# Altium schematic sheet GBTx_MGT.SchDoc: GBTx_MGT
size A; Organization: UCLA High Energy Physics; Address1: L3, 12a Rodborough Rd; Address2: Frenchs Forest; Address3: NSW; Address4: Australia 2086; DocumentNumber: 11; Revision: 2.0; SheetNumber: 11; SheetTotal: 23; CurrentDate: 9/6/2018; ModifiedDate: 9/6/2018; ProjectName: Project
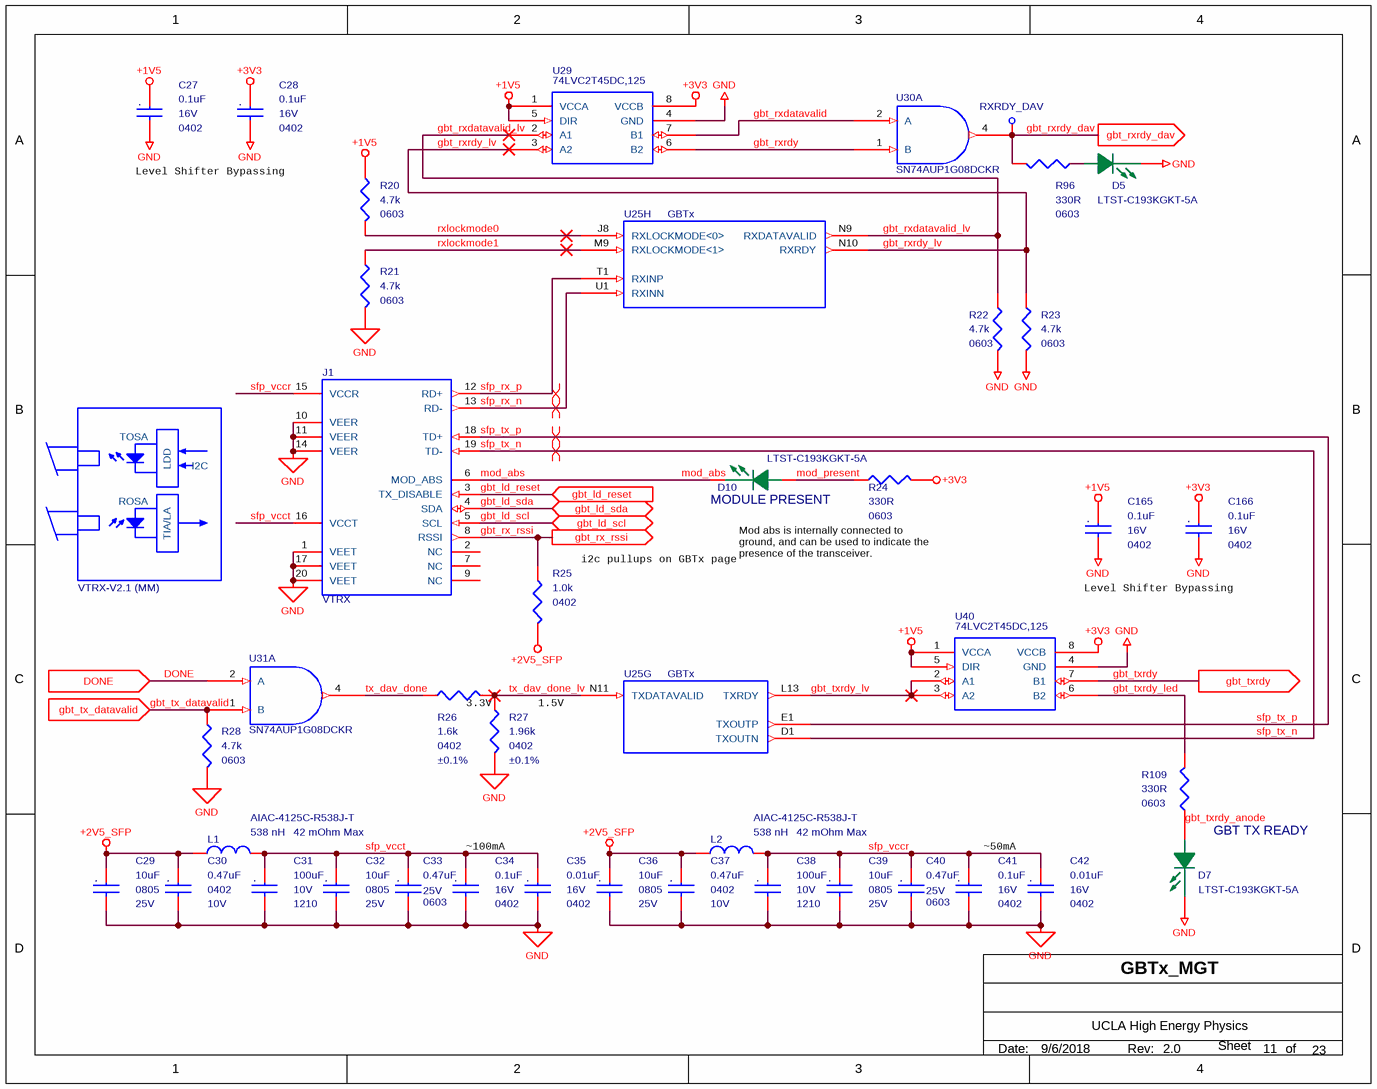
[diagram p0: GBTx_MGT.SchDoc]

## Parts
C27  0.1uF  package: 0402  Voltage - Rated: 16V  [MC_S6/SM/C_0402_IPC]
C28  0.1uF  package: 0402  Voltage - Rated: 16V  [MC_S6/SM/C_0402_IPC]
C29  10uF  Voltage - Rated: 25V  package: 0805  [MC_S6/SM/C_0805_IPC]
C30  0.47uF  Voltage - Rated: 10V  package: 0402  [MC_S6/SM/C_0402_IPC]
C31  100uF  Voltage - Rated: 10V  package: 1210  [MC_S6/SM/C_1210_IPC]
C32  10uF  Voltage - Rated: 25V  package: 0805  [MC_S6/SM/C_0805_IPC]
C33  0.47uF  Voltage - Rated: 25V  package: 0603  [MC_S6/SM/C_0603_IPC]
C34  0.1uF  package: 0402  Voltage - Rated: 16V  [MC_S6/SM/C_0402_IPC]
C35  0.01uF  Voltage - Rated: 16V  package: 0402  [MC_S6/SM/C_0402_IPC]
C36  10uF  Voltage - Rated: 25V  package: 0805  [MC_S6/SM/C_0805_IPC]
C37  0.47uF  Voltage - Rated: 10V  package: 0402  [MC_S6/SM/C_0402_IPC]
C38  100uF  Voltage - Rated: 10V  package: 1210  [MC_S6/SM/C_1210_IPC]
C39  10uF  Voltage - Rated: 25V  package: 0805  [MC_S6/SM/C_0805_IPC]
C40  0.47uF  Voltage - Rated: 25V  package: 0603  [MC_S6/SM/C_0603_IPC]
C41  0.1uF  package: 0402  Voltage - Rated: 16V  [MC_S6/SM/C_0402_IPC]
C42  0.01uF  Voltage - Rated: 16V  package: 0402  [MC_S6/SM/C_0402_IPC]
C165  0.1uF  package: 0402  Voltage - Rated: 16V  [MC_S6/SM/C_0402_IPC]
C166  0.1uF  package: 0402  Voltage - Rated: 16V  [MC_S6/SM/C_0402_IPC]
D5  LTST-C193KGKT-5A  [MC_S6/SM/LED_0603]
D7  LTST-C193KGKT-5A  [MC_S6/SM/LED_0603]
D10  LTST-C193KGKT-5A  [MC_S6/SM/LED_0603]
J1  VTRX  [MC_S6/SM/TE-1888247-1]
L1  538 nH  Manufacturer Part Number: AIAC-4125C-R538J-T  DC Resistance (DCR): 42 mOhm Max  [AIAC-4125C-R538J]
L2  538 nH  Manufacturer Part Number: AIAC-4125C-R538J-T  DC Resistance (DCR): 42 mOhm Max  [AIAC-4125C-R538J]
PCBM1  VTRX-V2.1 (MM)  [PCBM_CERN_VTRX V2.1 (MM)]
R20  4.7k  Supplier Device Package: 0603  [MC_S6/SM/R_0603_IPC]
R21  4.7k  Supplier Device Package: 0603  [MC_S6/SM/R_0603_IPC]
R22  4.7k  Supplier Device Package: 0603  [MC_S6/SM/R_0603_IPC]
R23  4.7k  Supplier Device Package: 0603  [MC_S6/SM/R_0603_IPC]
R24  330R  Supplier Device Package: 0603  [MC_S6/SM/R_0603_IPC]
R25  1.0k  package: 0402  [MC_S6/SM/R_0402_IPC]
R26  1.6k  Tolerance: ±0.1%  package: 0402  [MC_S6/SM/R_0402_IPC]
R27  1.96k  Tolerance: ±0.1%  package: 0402  [MC_S6/SM/R_0402_IPC]
R28  4.7k  Supplier Device Package: 0603  [MC_S6/SM/R_0603_IPC]
R96  330R  Supplier Device Package: 0603  [MC_S6/SM/R_0603_IPC]
R109  330R  Supplier Device Package: 0603  [MC_S6/SM/R_0603_IPC]
RXRDY_DAV  Test Point Via  [MC_S6/TH/TPVIA]  (value not drawn)  (no BOM)
U25  GBTx  [BGA400 GBT]  (parts G,H of 8)
U29  74LVC2T45DC,125  [VSSOP8 SOT765-1]
U30  SN74AUP1G08DCKR  [MC_S6/SM/SOT_SC70_DCK5]  (part A of 2)
U31  SN74AUP1G08DCKR  [MC_S6/SM/SOT_SC70_DCK5]  (part A of 2)
U40  74LVC2T45DC,125  [VSSOP8 SOT765-1]

## Ports
DONE (in), gbt_ld_reset (in), gbt_ld_scl (bidir), gbt_ld_sda (bidir), gbt_rx_rssi (out), gbt_rxrdy_dav (out), gbt_tx_datavalid (in), gbt_txrdy (out)

## Nets
+1V5: C27.1 C165.1 R20.1 U29.1(VCCA) U29.5(DIR) U40.1(VCCA) U40.5(DIR)
+2V5_SFP: C29.1 C30.1 C36.1 C37.1 L1.2 L2.2 R25.2
+3V3: C28.1 C166.1 R24.2 U29.8(VCCB) U40.8(VCCB)
GND: C27.2 C28.2 C29.2 C30.2 C31.2 C32.2 C33.2 C34.2 C35.2 C36.2 C37.2 C38.2 C39.2 C40.2 C41.2 C42.2 C165.2 C166.2 D5.K(CATHODE) D7.K(CATHODE) J1.1(VEET) J1.10(VEER) J1.11(VEER) J1.14(VEER) J1.17(VEET) J1.20(VEET) R21.2 R22.2 R23.2 R27.2 R28.2 U29.4(GND) U40.4(GND)
DONE: U31.2(A) ; port DONE
gbt_ld_reset: J1.3(TX_DISABLE) ; port gbt_ld_reset
gbt_ld_scl: J1.5(SCL) ; port gbt_ld_scl
gbt_ld_sda: J1.4(SDA) ; port gbt_ld_sda
gbt_rx_rssi: J1.8(RSSI) R25.1 ; port gbt_rx_rssi
gbt_rxdatavalid: U29.7(B1) U30.2(A)
gbt_rxdatavalid_lv: R22.1 U25.N9(RXDATAVALID) U29.2(A1)
gbt_rxrdy: U29.6(B2) U30.1(B)
gbt_rxrdy_dav: R96.2 RXRDY_DAV.1(In) U30.4(Y) ; port gbt_rxrdy_dav
gbt_rxrdy_lv: R23.1 U25.N10(RXRDY) U29.3(A2)
gbt_tx_datavalid: R28.1 U31.1(B) ; port gbt_tx_datavalid
gbt_txrdy: U40.7(B1) ; port gbt_txrdy
gbt_txrdy_anode: D7.A(ANODE) R109.1
gbt_txrdy_led: R109.2 U40.6(B2)
gbt_txrdy_lv: U25.L13(TXRDY) U40.2(A1) U40.3(A2)
mod_abs: D10.K(CATHODE) J1.6(MOD_ABS)
mod_present: D10.A(ANODE) R24.1
rxlockmode0: R20.2 U25.J8(RXLOCKMODE<0>)
rxlockmode1: R21.1 U25.M9(RXLOCKMODE<1>)
sfp_rx_n: J1.13(RD-) U25.U1(RXINN)
sfp_rx_p: J1.12(RD+) U25.T1(RXINP)
sfp_tx_n: J1.19(TD-) U25.D1(TXOUTN)
sfp_tx_p: J1.18(TD+) U25.E1(TXOUTP)
sfp_vccr: C38.1 C39.1 C40.1 C41.1 C42.1 J1.15(VCCR) L2.1
sfp_vcct: C31.1 C32.1 C33.1 C34.1 C35.1 J1.16(VCCT) L1.1
tx_dav_done: R26.1 U31.4(Y)
tx_dav_done_lv: R26.2 R27.1 U25.N11(TXDATAVALID)
NetD5_A: D5.A(ANODE) R96.1

Not connected (* = marked no-connect by the designer): J1 2(NC) 7(NC) 9(NC)

## Layout directives
differential pair: sfp_rx_n, sfp_rx_p, sfp_tx_n, sfp_tx_p

## Notes on the sheet
- Level Shifter Bypassing
- (near D10) MODULE PRESENT
- (near R25) i2c pullups on GBTx page
- Mod abs is internally connected to ground, and can be used to indicate the presence of the transceiver.
- 3.3V
- 1.5V
- (near C34) ~100mA
- ~50mA
- GBT TX READY
- Date:
- Rev:
- of
- Sheet
- (in symbol C0402C103K4RACTU) .
- (in symbol C0402C104K4RACTU) .
- (in symbol GRM21BR61E106KA73L) .
- (in symbol GRM155R61A474KE15D) .
- (in symbol GRM188R71E474KA12D) .
- (in symbol LMK325BJ107MM-T) .
- (in symbol PCBM_CERN_VTRX V2.1 (MM)_a) TOSA; LDD; I2C; ROSA; TIA/LA

## Library data of the parts
C27 C28 C34 C41 C165 C166 = C0402C104K4RACTU: CAP CER 0.1UF 16V X7R 0402; Manufacturer: KEMET; Capacitance: 0.10µF; Tolerance: ±10%; Supplier 1: Digi-Key; Manufacturer Part Number: C0402C104K4RACTU; RoHS: RoHS Compliant; Category: Capacitors; Stock 1: 3565698; Pricing 1: 1=0.11, 10=0.078, 25=0.0568, 50=0.0442, 100=0.0365, 250=0.03024, 500=0.02562, 1000=0.02121, 5000=0.01806 (USD); Packaging: Cut Tape (CT); Part Status: Active; Operating Temperature: -55°C ~ 125°C; Features: -; Ratings: -; Applications: General Purpose; Failure Rate: -; Mounting Type: Surface Mount, MLCC; Package / Case: 0402 (1005 Metric); Size / Dimension: 0.039" L x 0.020" W (1.00mm x 0.50mm); Height - Seated (Max): -; Thickness (Max): 0.022" (0.55mm); Lead Spacing: -; Lead Style: -; ComponentLink1URL: http://www.kemet.com/docfinder?Partnumber=C0402C104K4RACTU; ComponentLink1Description: http://www.kemet.com/docfinder?Partnumber=C0402C104K4RACTU; Supplier 2: Digi-Key; Stock 2: 3565998; Pricing 2: 1=0.11, 10=0.078, 25=0.0568, 50=0.0442, 100=0.0365, 250=0.03024, 500=0.02562, 1000=0.02121, 5000=0.01806 (USD); Supplier Part Number 1: 399-3521-1-ND; Supplier Part Number 2: 399-3521-6-ND; Temperature Coefficient: X7R
C29 C32 C36 C39 = GRM21BR61E106KA73L: CAP CER 10UF 25V X5R 0805; Manufacturer: Murata Electronics North America; Capacitance: 10µF; Tolerance: ±10%; Supplier 1: Digi-Key; Manufacturer Part Number: GRM21BR61E106KA73L; RoHS: RoHS Compliant; Category: Capacitors; Stock 1: 607428; Pricing 1: 1=0.19, 10=0.13, 50=0.0748, 100=0.0618, 250=0.052, 500=0.04356, 1000=0.03575 (USD); Packaging: Cut Tape (CT); Part Status: Active; Temperature Coefficient: X5R; Operating Temperature: -55°C ~ 85°C; Features: -; Ratings: -; Applications: General Purpose; Mounting Type: Surface Mount, MLCC; Package / Case: 0805 (2012 Metric); Size / Dimension: 0.079" L x 0.049" W (2.00mm x 1.25mm); Height - Seated (Max): -; Thickness (Max): 0.053" (1.35mm); Lead Spacing: -; Lead Style: -; ComponentLink1URL: http://www.murata.com/~/media/webrenewal/support/library/catalog/products/capacitor/mlcc/c02e.pdf; ComponentLink1Description: http://www.murata.com/~/media/webrenewal/support/library/catalog/products/capacitor/mlcc/c02e.pdf; Supplier 2: Digi-Key; Supplier Part Number 1: 490-5523-1-ND; Supplier Part Number 2: 490-5523-6-ND
C30 C37 = GRM155R61A474KE15D: CAP CER 0.47UF 10V X5R 0402; Manufacturer: Murata Electronics North America; Capacitance: 0.47µF; Tolerance: ±10%; Supplier 1: Digi-Key; Manufacturer Part Number: GRM155R61A474KE15D; RoHS: RoHS Compliant; Category: Capacitors; Stock 1: 506743; Pricing 1: 1=0.1, 10=0.064, 50=0.0344, 100=0.0292, 250=0.02384, 500=0.0204, 1000=0.0159, 5000=0.01325 (USD); Packaging: Cut Tape (CT); Part Status: Active; Operating Temperature: -55°C ~ 85°C; Features: -; Ratings: -; Applications: General Purpose; Mounting Type: Surface Mount, MLCC; Package / Case: 0402 (1005 Metric); Size / Dimension: 0.039" L x 0.020" W (1.00mm x 0.50mm); Height - Seated (Max): -; Thickness (Max): 0.022" (0.55mm); Lead Spacing: -; ComponentLink1URL: http://www.murata.com/~/media/webrenewal/support/library/catalog/products/capacitor/mlcc/c02e.pdf; ComponentLink1Description: http://www.murata.com/~/media/webrenewal/support/library/catalog/products/capacitor/mlcc/c02e.pdf; Supplier 2: Digi-Key; Stock 2: 506743; Pricing 2: 1=0.1, 10=0.064, 50=0.0344, 100=0.0292, 250=0.02384, 500=0.0204, 1000=0.0159, 5000=0.01325 (USD); Supplier Part Number 1: 490-3264-1-ND; Supplier Part Number 2: 490-3264-6-ND; Temperature Coefficient: X5R; Lead Style: -
C31 C38 = LMK325BJ107MM-T: CAP CER 100UF 10V X5R 1210; Manufacturer: Taiyo Yuden; Capacitance: 100µF; Tolerance: ±20%; Supplier 1: Digi-Key; Manufacturer Part Number: LMK325BJ107MM-T; RoHS: RoHS Compliant; Category: Capacitors; Stock 1: 345948; Pricing 1: 1=1.15, 10=0.909, 25=0.8332, 50=0.7878, 100=0.6818, 250=0.60608 (USD); Packaging: Cut Tape (CT); Part Status: Active; Operating Temperature: -55°C ~ 85°C; Mounting Type: Surface Mount, MLCC; Package / Case: 1210 (3225 Metric); Size / Dimension: 0.126" L x 0.098" W (3.20mm x 2.50mm); Height - Seated (Max): -; Lead Spacing: -; Features: -; ComponentLink1URL: http://www.yuden.co.jp/productdata/catalog/en/mlcc_all_e.pdf; ComponentLink1Description: http://www.yuden.co.jp/productdata/catalog/en/mlcc_all_e.pdf; Supplier 2: Digi-Key; Stock 2: 345948; Pricing 2: 1=1.16, 10=0.914, 25=0.8376, 50=0.792, 100=0.6855, 250=0.60932 (USD); Supplier Part Number 1: 587-1965-1-ND; Supplier Part Number 2: 587-1965-6-ND; Temperature Coefficient: X5R; Ratings: -; Applications: General Purpose; Thickness (Max): 0.106" (2.70mm); Lead Style: -
C33 C40 = GRM188R71E474KA12D: CAP CER 0.47UF 25V X7R 0603; Manufacturer: Murata; Capacitance: 0.47µF; Tolerance: ±10%; Product Training Modules: High-Cap Multilayer Ceramic Capacitors; Featured Product: GA3 Safety Recognized Caps and Hi-Cap MLCC; Online Catalog: GRM Series; Other Names: 490-3291-2; Supplier 1: Digikey; Manufacturer Part Number: GRM188R71E474KA12D; Category: Capacitors; Stock 1: 616139; Pricing 1: 1=0.17, 10=0.114, 50=0.0656, 100=0.0542, 250=0.0456, 500=0.0382, 1000=0.0314 (USD); Packaging: Tape & Reel (TR); Operating Temperature: -55°C ~ 125°C; Features: -; Ratings: -; Applications: General Purpose; Mounting Type: Surface Mount, MLCC; Package / Case: 0603 (1608 Metric); Size / Dimension: 0.063" L x 0.031" W (1.60mm x 0.80mm); Height - Seated (Max): -; Thickness (Max): 0.035" (0.90mm); Lead Spacing: -; Lead Style: -; ComponentLink1URL: https://datasheet.ciiva.com/16293/grm188r71e474ka12d-16293088.pdf; ComponentLink1Description: https://datasheet.ciiva.com/16293/grm188r71e474ka12d-16293088.pdf; Supplier 2: Digikey; Stock 2: 616139; Pricing 2: 1=0.17, 10=0.114, 50=0.0656, 100=0.0542, 250=0.0456, 500=0.0382, 1000=0.0314 (USD); Supplier Part Number 1: 490-3291-1-ND; Supplier Part Number 2: 490-3291-6-ND; Temperature Coefficient: X7R; Standard Package: 4,000; Family: Ceramic Capacitors; Series: GRM; ComponentLink2URL: https://datasheet.ciiva.com/7937/1747458-7937650.pdf; ComponentLink2Description: https://datasheet.ciiva.com/7937/1747458-7937650.pdf; ComponentLink3URL: https://datasheet.ciiva.com/134/grm188r71e474ka12-01-134308.pdf; ComponentLink3Description: https://datasheet.ciiva.com/134/grm188r71e474ka12-01-134308.pdf; ComponentLink4URL: https://datasheet.ciiva.com/134/grm188r71e474ka12-01-134309.pdf; ComponentLink4Description: https://datasheet.ciiva.com/134/grm188r71e474ka12-01-134309.pdf; ComponentLink5URL: https://datasheet.ciiva.com/134/grm188r71e474ka12-01-134310.pdf; ComponentLink5Description: https://datasheet.ciiva.com/134/grm188r71e474ka12-01-134310.pdf; ComponentLink6URL: https://datasheet.ciiva.com/22703/1747458-22703340.pdf; ComponentLink6Description: https://datasheet.ciiva.com/22703/1747458-22703340.pdf; ComponentLink7URL: https://datasheet.ciiva.com/29199/454518-da-01-en-vs-kondensator-0603-29199596.pdf; ComponentLink7Description: https://datasheet.ciiva.com/29199/454518-da-01-en-vs-kondensator-0603-29199596.pdf; ComponentLink8URL: https://datasheet.ciiva.com/34302/1857559-34302862.pdf; ComponentLink8Description: https://datasheet.ciiva.com/34302/1857559-34302862.pdf
C35 C42 = C0402C103K4RACTU: CAP CER 10nF 16V X7R 0402; Manufacturer: KEMET; Capacitance: 10000pF; Tolerance: ±10%; Supplier 1: Digi-Key; Manufacturer Part Number: C0402C103K4RACTU; RoHS: RoHS Compliant; Category: Capacitors; Stock 1: 605739; Pricing 1: 1=0.1, 10=0.02, 25=0.0144, 50=0.0108, 100=0.0088, 250=0.00732, 500=0.00626, 1000=0.00492, 5000=0.00412 (USD); Packaging: Cut Tape (CT); Part Status: Active; Temperature Coefficient: X7R; Operating Temperature: -55°C ~ 125°C; Features: -; Ratings: -; Applications: General Purpose; Failure Rate: -; Mounting Type: Surface Mount, MLCC; Package / Case: 0402 (1005 Metric); Size / Dimension: 0.039" L x 0.020" W (1.00mm x 0.50mm); Height - Seated (Max): -; Thickness (Max): 0.022" (0.55mm); Lead Spacing: -; Lead Style: -; ComponentLink1URL: http://www.kemet.com/docfinder?Partnumber=C0402C103K4RACTU; ComponentLink1Description: http://www.kemet.com/docfinder?Partnumber=C0402C103K4RACTU; Supplier 2: Digi-Key; Stock 2: 605739; Pricing 2: 1=0.1, 10=0.02, 25=0.0144, 50=0.0108, 100=0.0088, 250=0.00732, 500=0.00626, 1000=0.00492, 5000=0.00412 (USD); Supplier Part Number 1: 399-1038-1-ND; Supplier Part Number 2: 399-1038-6-ND
D5 D7 D10 = LTST-C193KGKT-5A: LED GREEN CLEAR 0603 SMD; Manufacturer: Lite-On Inc.; Current - Test: 5mA; Lens Color: Colorless; Lens Style/Size: Rectangle with Flat Top, 1.15mm x 0.80mm; Millicandela Rating: 16.25mcd; Viewing Angle: 130°; Voltage - Forward (Vf) (Typ): 2V; Wavelength - Dominant: 572nm; Wavelength - Peak: 574nm; Category: Optoelectronics; Color: Green; ComponentLink1Description: http://optoelectronics.liteon.com/upload/download/DS22-2007-0094/LTST-C193KGKT-5A.PDF; ComponentLink1URL: http://optoelectronics.liteon.com/upload/download/DS22-2007-0094/LTST-C193KGKT-5A.PDF; Features: -; Height (Max): 0.45mm; Lens Transparency: Clear; Manufacturer Part Number: LTST-C193KGKT-5A; Mounting Type: Surface Mount; Package / Case: 0603 (1608 Metric); Packaging: Cut Tape (CT); Part Status: Active; Pricing 1: 1=0.41, 10=0.296, 25=0.2268, 100=0.148, 250=0.10852, 500=0.0921, 1000=0.07565, 2500=0.06578 (USD); Pricing 2: 1=0.41, 10=0.296, 25=0.2268, 100=0.148, 250=0.10852, 500=0.0921, 1000=0.07565, 2500=0.06578 (USD); RoHS: RoHS Compliant; Size / Dimension: 1.60mm L x 0.80mm W; Stock 1: 83440; Stock 2: 83440; Supplier 1: Digi-Key; Supplier 2: Digi-Key; Supplier Device Package: Chip LED; Supplier Part Number 1: 160-1828-1-ND; Supplier Part Number 2: 160-1828-6-ND
J1 = VTRX: CONN FP+ CAGE 30AU SMD; Manufacturer: TE Connectivity AMP Connectors; Manufacturer Part Number: 1888247-1; Connector Style: Receptacle; Connector Type: SFP+; Number of Positions: 20; Category: Connectors, Interconnects; ComponentLink1Description: http://www.te.com/commerce/DocumentDelivery/DDEController?Action=srchrtrv&DocNm=1888247&DocType=Customer+Drawing&DocLang=English; ComponentLink1URL: http://www.te.com/commerce/DocumentDelivery/DDEController?Action=srchrtrv&DocNm=1888247&DocType=Customer+Drawing&DocLang=English; Contact Finish: Gold; Contact Finish Thickness: 30µin (0.76µm); Features: Board Guide; Mounting Type: Surface Mount, Right Angle; Packaging: Cut Tape (CT); Part Status: Active; Pricing 1: 1=2.44, 10=2.21, 50=1.9844, 100=1.8942 (USD); Pricing 2: 1=2.44, 10=2.21, 50=1.9844, 100=1.8942 (USD); RoHS: RoHS Compliant; Stock 1: 25904; Stock 2: 25904; Supplier 1: Digi-Key; Supplier 2: Digi-Key; Supplier Part Number 1: A97943CT-ND; Supplier Part Number 2: A97943DKR-ND; Termination: Solder
L1 L2 = AIAC-4125C-R538J: IND 538NH 2A 42 MOHM SMD; Manufacturer: Abracon LLC; Type: Wirewound; Material - Core: Air; Tolerance: ±5%; Shielding: Unshielded; Q @ Freq: 100 @ 50MHz; Supplier 1: Digi-Key; RoHS: RoHS Compliant; Category: Inductors, Coils, Chokes; Stock 1: 1963; Pricing 1: 1=0.83, 10=0.725, 100=0.5175, 500=0.4347 (USD); Packaging: Cut Tape (CT); Part Status: Active; Ratings: -; Operating Temperature: -40°C ~ 125°C; Mounting Type: Surface Mount; Package / Case: Nonstandard; Supplier Device Package: -; Size / Dimension: 0.354" L x 0.173" W (9.00mm x 4.40mm); Height - Seated (Max): 0.197" (5.00mm); ComponentLink1URL: https://abracon.com/Magnetics/chips/AIAC-4125C.pdf; ComponentLink1Description: https://abracon.com/Magnetics/chips/AIAC-4125C.pdf; Supplier Part Number 1: 535-12016-1-ND
PCBM1 = PCBM_CERN_VTRX V2.1 (MM)_a: CERN VTRX V2.1 Multi-Mode (MM); Part Description: Versatile Transceiver Module VTRX V2.1 Multi-Mode Configuration (MM); PressFit: No; Bonding: No; Part Number: PCBM_CERN_VTRX V2.1 (MM)_a; Component Kind: Standard; Component Type: Standard; Device: VTRX-V2.1 (MM); PackageDescription: Versatile Transceiver Module; Manufacturer: CERN; Manufacturer Part Number: VTRX-V2.1 (MM); Pin Count: 0; Mounted: Yes; Socket: No; SMD: No; Sense: No; ComponentHeight: 16.5mm; Author: CERN DEM JLC; HelpURL: \\cern.ch\dfs\Applications\Altium\Datasheets\PCBM_CERN_VTRX V2.1 (MM).pdf; CreateDate: 19/12/2013; LatestRevisionDate: 19/12/2013
R20-R23 R28 = CR0603-FX-4701ELF: RES SMD 4.7K OHM 1% 1/10W 0603; Manufacturer: Bourns Inc.; Power (Watts): 0.1W, 1/10W; Temperature Coefficient: ±100ppm/°C; Tolerance: ±1%; Supplier 1: Digi-Key; Manufacturer Part Number: CR0603-FX-4701ELF; RoHS: RoHS Compliant; Category: Resistors; Stock 1: 43560; Pricing 1: 1=0.1, 10=0.021, 100=0.0086, 1000=0.00385, 2500=0.00334 (USD); Packaging: Cut Tape (CT); Part Status: Active; Resistance (Ohms): 4.7k; Composition: Thick Film; Features: Moisture Resistant; Operating Temperature: -55°C ~ 155°C; Package / Case: 0603 (1608 Metric); Size / Dimension: 0.063" L x 0.031" W (1.60mm x 0.80mm); Height - Seated (Max): 0.022" (0.55mm); Failure Rate: -; ComponentLink1URL: http://www.bourns.com/docs/Product-Datasheets/CHPREZTR.pdf; ComponentLink1Description: http://www.bourns.com/docs/Product-Datasheets/CHPREZTR.pdf; Supplier 2: Digi-Key; Stock 2: 43560; Pricing 2: 1=0.1, 10=0.021, 100=0.0086, 1000=0.00385, 2500=0.00334 (USD); Supplier Part Number 1: CR0603-FX-4701ELFCT-ND; Supplier Part Number 2: CR0603-FX-4701ELFDKR-ND
R24 R109 = CR0603-FX-3300ELF: RES SMD 330 OHM 1% 1/10W 0603; Manufacturer: Bourns Inc.; Resistance (Ohms): 330; Power (Watts): 0.1W, 1/10W; Temperature Coefficient: ±100ppm/°C; Tolerance: ±1%; Supplier 1: Digi-Key; Manufacturer Part Number: CR0603-FX-3300ELF; RoHS: RoHS Compliant; Category: Resistors; Stock 1: 45245; Pricing 1: 1=0.1, 10=0.023, 100=0.0092, 1000=0.00414, 2500=0.00359 (USD); Packaging: Cut Tape (CT); Part Status: Active; Composition: Thick Film; Features: Moisture Resistant; Operating Temperature: -55°C ~ 155°C; Package / Case: 0603 (1608 Metric); Size / Dimension: 0.063" L x 0.031" W (1.60mm x 0.80mm); Height - Seated (Max): 0.022" (0.55mm); Failure Rate: -; ComponentLink1URL: http://www.bourns.com/docs/Product-Datasheets/CHPREZTR.pdf; ComponentLink1Description: http://www.bourns.com/docs/Product-Datasheets/CHPREZTR.pdf; Supplier 2: Digi-Key; Stock 2: 45245; Pricing 2: 1=0.1, 10=0.023, 100=0.0092, 1000=0.00414, 2500=0.00359 (USD); Supplier Part Number 1: CR0603-FX-3300ELFCT-ND; Supplier Part Number 2: CR0603-FX-3300ELFDKR-ND
R25 = ERA-2AEB102X: RES SMD 1.0K OHM 0.1% 1/16W 0402; Manufacturer: Panasonic Electronic Components; Power (Watts): 0.063W, 1/16W; Temperature Coefficient: ±25ppm/°C; Tolerance: ±0.1%; Supplier 1: Digi-Key; Manufacturer Part Number: ERA-2AEB102X; RoHS: RoHS Compliant; Category: Resistors; Stock 1: 473705; Pricing 1: 1=0.45, 10=0.321, 100=0.1283, 1000=0.06322, 2500=0.05858, 5000=0.053 (USD); Packaging: Cut Tape (CT); Part Status: Active; Composition: Thin Film; Features: Automotive AEC-Q200; Operating Temperature: -55°C ~ 155°C; Package / Case: 0402 (1005 Metric); Size / Dimension: 0.039" L x 0.020" W (1.00mm x 0.50mm); Height - Seated (Max): 0.016" (0.40mm); Failure Rate: -; ComponentLink1URL: https://industrial.panasonic.com/cdbs/www-data/pdf/RDM0000/AOA0000C307.pdf; ComponentLink1Description: https://industrial.panasonic.com/cdbs/www-data/pdf/RDM0000/AOA0000C307.pdf; Supplier 2: Digi-Key; Stock 2: 473705; Pricing 2: 1=0.45, 10=0.321, 100=0.1283, 1000=0.06322, 2500=0.05858, 5000=0.053 (USD); Supplier Part Number 1: P1.0KDCCT-ND; Supplier Part Number 2: P1.0KDCDKR-ND; Supplier Device Package: 0402
R26 = ERA-2AEB162X: RES SMD 1.6K OHM 0.1% 1/16W 0402; Manufacturer: Panasonic Electronic Components; Power (Watts): 0.063W, 1/16W; Temperature Coefficient: ±25ppm/°C; Supplier 1: Digi-Key; Manufacturer Part Number: ERA-2AEB162X; RoHS: RoHS Compliant; Category: Resistors; Stock 1: 15584; Pricing 1: 1=0.61, 50=0.238, 100=0.1913, 250=0.14876, 500=0.1122, 1000=0.0867, 5000=0.0646 (USD); Packaging: Cut Tape (CT); Part Status: Active; Resistance (Ohms): 1.6k; Composition: Thin Film; Features: Automotive AEC-Q200; Operating Temperature: -55°C ~ 155°C; Package / Case: 0402 (1005 Metric); Size / Dimension: 0.039" L x 0.020" W (1.00mm x 0.50mm); Height - Seated (Max): 0.016" (0.40mm); Number of Terminations: 2; Failure Rate: -; ComponentLink1URL: https://industrial.panasonic.com/cdbs/www-data/pdf/RDA0000/AOA0000C237.pdf; ComponentLink1Description: https://industrial.panasonic.com/cdbs/www-data/pdf/RDA0000/AOA0000C237.pdf; Supplier 2: Digi-Key; Stock 2: 15584; Pricing 2: 1=0.61, 50=0.238, 100=0.1913, 250=0.14876, 500=0.1122, 1000=0.0867, 5000=0.0646 (USD); Supplier Part Number 1: P1.6KDCCT-ND; Supplier Part Number 2: P1.6KDCDKR-ND; Supplier Device Package: 0402
R27 = ERA-2AEB1961X: RES SMD 1.96K OHM 0.1% 1/16W 0402; Manufacturer: Panasonic Electronic Components; Power (Watts): 0.063W, 1/16W; Temperature Coefficient: ±25ppm/°C; Supplier 1: Digi-Key; Manufacturer Part Number: ERA-2AEB1961X; RoHS: RoHS Compliant; Category: Resistors; Stock 1: 36796; Pricing 1: 1=0.45, 10=0.321, 100=0.1283, 1000=0.06322, 2500=0.05858, 5000=0.053 (USD); Packaging: Cut Tape (CT); Part Status: Active; Composition: Thin Film; Features: Automotive AEC-Q200; Operating Temperature: -55°C ~ 155°C; Package / Case: 0402 (1005 Metric); Size / Dimension: 0.039" L x 0.020" W (1.00mm x 0.50mm); Height - Seated (Max): 0.016" (0.40mm); Failure Rate: -; ComponentLink1URL: https://industrial.panasonic.com/cdbs/www-data/pdf/RDM0000/AOA0000C307.pdf; ComponentLink1Description: https://industrial.panasonic.com/cdbs/www-data/pdf/RDM0000/AOA0000C307.pdf; Supplier 2: Digi-Key; Stock 2: 36796; Pricing 2: 1=0.45, 10=0.321, 100=0.1283, 1000=0.06322, 2500=0.05858, 5000=0.053 (USD); Supplier Part Number 1: P1.96KDCCT-ND; Supplier Part Number 2: P1.96KDCDKR-ND; Supplier Device Package: 0402
R96 = CR0603-FX-3300ELF: RES SMD 330 OHM 1% 1/10W 0603; Manufacturer: Bourns Inc.; Power (Watts): 0.1W, 1/10W; Temperature Coefficient: ±100ppm/°C; Resistance (Ohms): 330; Tolerance: ±1%; Supplier 1: Digi-Key; Manufacturer Part Number: CR0603-FX-3300ELF; RoHS: RoHS Compliant; Category: Resistors; Stock 1: 45245; Pricing 1: 1=0.1, 10=0.023, 100=0.0092, 1000=0.00414, 2500=0.00359 (USD); Packaging: Cut Tape (CT); Part Status: Active; Composition: Thick Film; Features: Moisture Resistant; Operating Temperature: -55°C ~ 155°C; Package / Case: 0603 (1608 Metric); Size / Dimension: 0.063" L x 0.031" W (1.60mm x 0.80mm); Height - Seated (Max): 0.022" (0.55mm); Failure Rate: -; ComponentLink1URL: http://www.bourns.com/docs/Product-Datasheets/CHPREZTR.pdf; ComponentLink1Description: http://www.bourns.com/docs/Product-Datasheets/CHPREZTR.pdf; Supplier Part Number 1: CR0603-FX-3300ELFCT-ND; Supplier 2: Digi-Key; Stock 2: 45245; Pricing 2: 1=0.1, 10=0.023, 100=0.0092, 1000=0.00414, 2500=0.00359 (USD); Supplier Part Number 2: CR0603-FX-3300ELFDKR-ND
RXRDY_DAV = TPVIA: COMPSIDE: TOP; COMPGROUP: 0; mfgr: Layout; COMPROT: 0; Package: 90; mfgr_id: TPVIA; mfgr_foot: TPVIA
U29 U40 = 74LVC2T45DC,125: IC TRNSLTR BIDIRECTIONAL 8VSSOP; Manufacturer: Nexperia USA Inc.; Translator Type: Voltage Level; Channels per Circuit: 2; Output Type: Tri-State, Non-Inverted; Data Rate: 420Mbps; Propagation Delay: 48.6ns; Min Supply Voltage: 1.2V; Max Supply Voltage: 5.5V; Max Power Dissipation: 250mW; Number of Elements: 1; Logic Function: Transceiver,Translator; Turn-On Delay Time: 15.2ns; High Level Output Current: -32mA; Low Level Output Current: 32mA; Quiescent Current: 8uA; Polarity: Non-Inverting; Supplier 1: Digi-Key; Manufacturer Part Number: 74LVC2T45DC,125; RoHS: RoHS Compliant; Category: Integrated Circuits (ICs); Stock 1: 0; Pricing 1: 1=0.58, 10=0.51, 100=0.3909, 500=0.309, 1000=0.2472 (USD); Packaging: Digi-Reel®; Part Status: Active; Channel Type: Bidirectional; Input Signal: -; Output Signal: -; Operating Temperature: -40°C ~ 125°C (TA); Features: -; Mounting Type: Surface Mount; Package / Case: 8-VFSOP (0.091", 2.30mm Width); Supplier Device Package: 8-VSSOP; Base Part Number: 74LVC2T45; ComponentLink1URL: https://assets.nexperia.com/documents/data-sheet/74LVC_LVCH2T45.pdf; ComponentLink1Description: https://assets.nexperia.com/documents/data-sheet/74LVC_LVCH2T45.pdf; Supplier Part Number 1: 1727-4578-6-ND; Mount: Surface Mount; Case/Package: VSSOP; Number of Pins: 8; Contact Plating: Gold; Min Operating Temperature: -40°C; Max Operating Temperature: 125°C; Number of Channels: 2; Package Quantity: 3000; Direction: Bidirectional; Number of Bits: 2; Radiation Hardening: No; REACH SVHC: No SVHC; Lead Free: Lead Free; ComponentLink2URL: https://datasheet.ciiva.com/1900/74lvc-lvch2t45-1900049.pdf; ComponentLink2Description: https://datasheet.ciiva.com/1900/74lvc-lvch2t45-1900049.pdf; ComponentLink3URL: https://datasheet.ciiva.com/1900/74lvc-lvch2t45-1900050.pdf; ComponentLink3Description: https://datasheet.ciiva.com/1900/74lvc-lvch2t45-1900050.pdf; ComponentLink4URL: https://datasheet.ciiva.com/1900/74lvc-lvch2t45-1900051.pdf; ComponentLink4Description: https://datasheet.ciiva.com/1900/74lvc-lvch2t45-1900051.pdf; ComponentLink5URL: https://datasheet.ciiva.com/16406/74lvc-lvch2t45-16406598.pdf; ComponentLink5Description: https://datasheet.ciiva.com/16406/74lvc-lvch2t45-16406598.pdf; ComponentLink6URL: https://datasheet.ciiva.com/4798/74lvc-lvch2t45-4798887.pdf; ComponentLink6Description: https://datasheet.ciiva.com/4798/74lvc-lvch2t45-4798887.pdf; ComponentLink7URL: https://datasheet.ciiva.com/16591/74lvc-lvch2t45-16591338.pdf; ComponentLink7Description: https://datasheet.ciiva.com/16591/74lvc-lvch2t45-16591338.pdf; ComponentLink8URL: https://datasheet.ciiva.com/15086/getdatasheetpartid-422533-15086781.pdf; ComponentLink8Description: https://datasheet.ciiva.com/15086/getdatasheetpartid-422533-15086781.pdf
U30 U31 = SN74AUP1G08DCKR: IC GATE AND 1CH 2-INP 5-TSSOP; Manufacturer: Texas Instruments; Manufacturer Part Number: SN74AUP1G08DCKT; Logic Type: AND Gate; Number of Inputs: 2; Voltage - Supply: 0.8 V ~ 3.6 V; Current - Output High, Low: 4mA, 4mA; Logic Level - Low: 0.7 V ~ 0.9 V; Logic Level - High: 1.6 V ~ 2 V; Max Propagation Delay @ V, Max CL: 6.2ns @ 3.3V, 30pF; Supplier 1: Digi-Key; RoHS: RoHS Compliant; Category: Integrated Circuits (ICs); Stock 1: 7470; Pricing 1: 1=0.8, 10=0.707, 100=0.542 (USD); Packaging: Cut Tape (CT); Part Status: Active; Features: -; Operating Temperature: -40°C ~ 85°C; Mounting Type: Surface Mount; Supplier Device Package: SC-70-5; Package / Case: 5-TSSOP, SC-70-5, SOT-353; ComponentLink1URL: http://www.ti.com/lit/ds/symlink/sn74aup1g08.pdf; ComponentLink1Description: http://www.ti.com/lit/ds/symlink/sn74aup1g08.pdf; Supplier 2: Digi-Key; Stock 2: 7470; Pricing 2: 1=0.8, 10=0.707, 100=0.542 (USD); Supplier Part Number 1: 296-32258-1-ND; Supplier Part Number 2: 296-32258-6-ND